# Altium project LineSensor32.PrjPcb
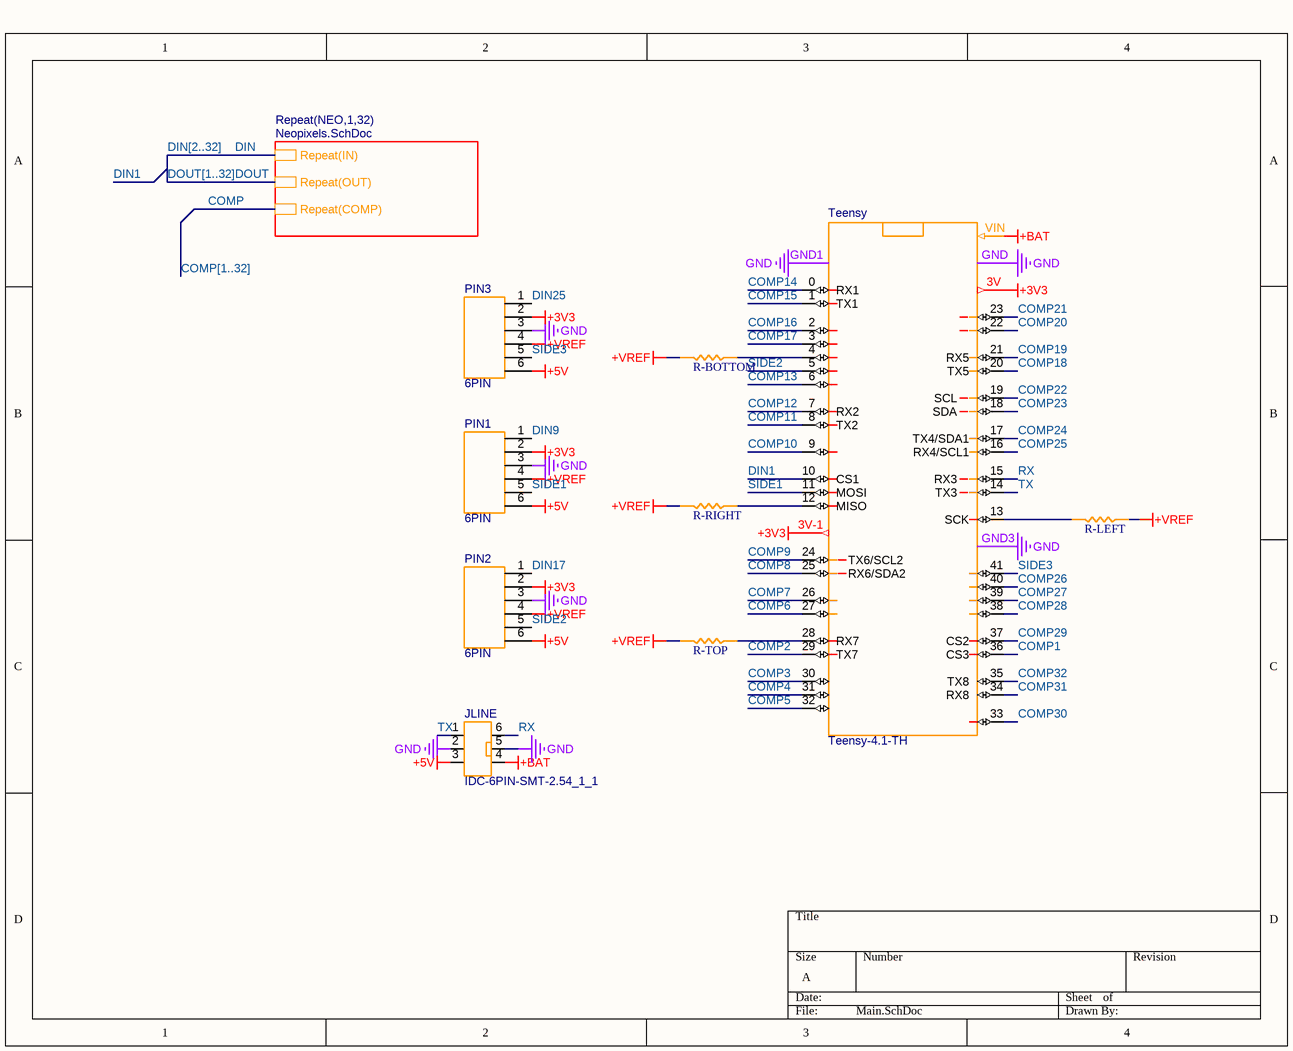
[diagram p0: Main.SchDoc]
3 sheets, 207 parts. Net scope: hierarchical (ports join the sheet entries above them; power ports are global).
Board file: LineSensor32.PcbDoc
Sheets:
  Main.SchDoc
    NEO1 = Neopixels.SchDoc
    NEO2 = Neopixels.SchDoc
    NEO3 = Neopixels.SchDoc
    NEO4 = Neopixels.SchDoc
    NEO5 = Neopixels.SchDoc
    NEO6 = Neopixels.SchDoc
    NEO7 = Neopixels.SchDoc
    NEO8 = Neopixels.SchDoc
    NEO9 = Neopixels.SchDoc
    NEO10 = Neopixels.SchDoc
    NEO11 = Neopixels.SchDoc
    NEO12 = Neopixels.SchDoc
    NEO13 = Neopixels.SchDoc
    NEO14 = Neopixels.SchDoc
    NEO15 = Neopixels.SchDoc
    NEO16 = Neopixels.SchDoc
    NEO17 = Neopixels.SchDoc
    NEO18 = Neopixels.SchDoc
    NEO19 = Neopixels.SchDoc
    NEO20 = Neopixels.SchDoc
    NEO21 = Neopixels.SchDoc
    NEO22 = Neopixels.SchDoc
    NEO23 = Neopixels.SchDoc
    NEO24 = Neopixels.SchDoc
    NEO25 = Neopixels.SchDoc
    NEO26 = Neopixels.SchDoc
    NEO27 = Neopixels.SchDoc
    NEO28 = Neopixels.SchDoc
    NEO29 = Neopixels.SchDoc
    NEO30 = Neopixels.SchDoc
    NEO31 = Neopixels.SchDoc
    NEO32 = Neopixels.SchDoc
  Comparator.SchDoc

## Sheet Main.SchDoc
size A; SheetNumber: 1; SheetTotal: 3

### Parts
JLINE  IDC-6PIN-SMT-2.54_1_1  [IDC-6PIN-SMT-2.54]
PIN1  6PIN  [6PIN]
PIN2  6PIN  [6PIN]
PIN3  6PIN  [6PIN]
R-BOTTOM  RES_0603  [RES_0603]  (value not drawn)
R-LEFT  RES_0603  [RES_0603]  (value not drawn)
R-RIGHT  RES_0603  [RES_0603]  (value not drawn)
R-TOP  RES_0603  [RES_0603]  (value not drawn)
Teensy  Teensy-4.1-TH  [Teensy-4.1-TH]

### Sub-sheets
Repeat(NEO,1,32) = Neopixels.SchDoc: Repeat(IN), Repeat(OUT), Repeat(COMP)

### Nets
+3V3: PIN1.2 PIN2.2 PIN3.2 Teensy.3V Teensy.3V-1
+5V: JLINE.3 PIN1.6 PIN2.6 PIN3.6
+BAT: JLINE.4 Teensy.VIN
+VREF: PIN1.4 PIN2.4 PIN3.4 R-BOTTOM.1 R-LEFT.2 R-RIGHT.1 R-TOP.1
GND: JLINE.2 JLINE.5 PIN1.3 PIN2.3 PIN3.3 Teensy.GND Teensy.GND1 Teensy.GND3
COMP: sheet Repeat(NEO,1,32)/Repeat(COMP)
COMP1: Teensy.36(CS3)
COMP2: Teensy.29(TX7)
COMP3: Teensy.30
COMP4: Teensy.31
COMP5: Teensy.32
COMP6: Teensy.27
COMP7: Teensy.26
COMP8: Teensy.25(RX6/SDA2)
COMP9: Teensy.24(TX6/SCL2)
COMP10: Teensy.9
COMP11: Teensy.8(TX2)
COMP12: Teensy.7(RX2)
COMP13: Teensy.6
COMP14: Teensy.0(RX1)
COMP15: Teensy.1(TX1)
COMP16: Teensy.2
COMP17: Teensy.3
COMP18: Teensy.20(TX5)
COMP19: Teensy.21(RX5)
COMP20: Teensy.22
COMP21: Teensy.23
COMP22: Teensy.19(SCL)
COMP23: Teensy.18(SDA)
COMP24: Teensy.17(TX4/SDA1)
COMP25: Teensy.16(RX4/SCL1)
COMP26: Teensy.40
COMP27: Teensy.39
COMP28: Teensy.38
COMP29: Teensy.37(CS2)
COMP30: Teensy.33
COMP31: Teensy.34(RX8)
COMP32: Teensy.35(TX8)
DIN: sheet Repeat(NEO,1,32)/Repeat(IN)
DIN1: Teensy.10(CS1)
DIN9: PIN1.1  [also labelled DOUT8]
DIN17: PIN2.1  [also labelled DOUT16]
DIN25: PIN3.1  [also labelled DOUT24]
DOUT: sheet Repeat(NEO,1,32)/Repeat(OUT)
RX: JLINE.6 Teensy.15(RX3)
SIDE1: PIN1.5 Teensy.11(MOSI)
SIDE2: PIN2.5 Teensy.5
SIDE3: PIN3.5 Teensy.41
TX: JLINE.1 Teensy.14(TX3)
NetR-BOTTOM_2: R-BOTTOM.2 Teensy.4
NetR-LEFT_1: R-LEFT.1 Teensy.13(SCK)
NetR-RIGHT_2: R-RIGHT.2 Teensy.12(MISO)
NetR-TOP_2: R-TOP.2 Teensy.28(RX7)

### Buses and harness runs
bus COMP[1..32]
bus DIN[2..32] = DOUT[1..32]

### Library data of the parts
R-BOTTOM R-LEFT R-RIGHT R-TOP = CMP-009-00178-1: Resistor SMD 0603 generic; Component Type: Standard; Pins: 2; Design Item ID: RES_0603; Source: GenericRC.SchLib

## Sheet Neopixels.SchDoc
size A; SheetNumber: 2; SheetTotal: 3
Used 32 times, as channels NEO1, NEO2, NEO3, NEO4, NEO5, NEO6, NEO7, NEO8, NEO9, NEO10, NEO11, NEO12, NEO13, NEO14, NEO15, NEO16, NEO17, NEO18, NEO19, NEO20, NEO21, NEO22, NEO23, NEO24, NEO25, NEO26, NEO27, NEO28, NEO29, NEO30, NEO31, NEO32. Parts and nets are listed once, with the designators drawn on the sheet.
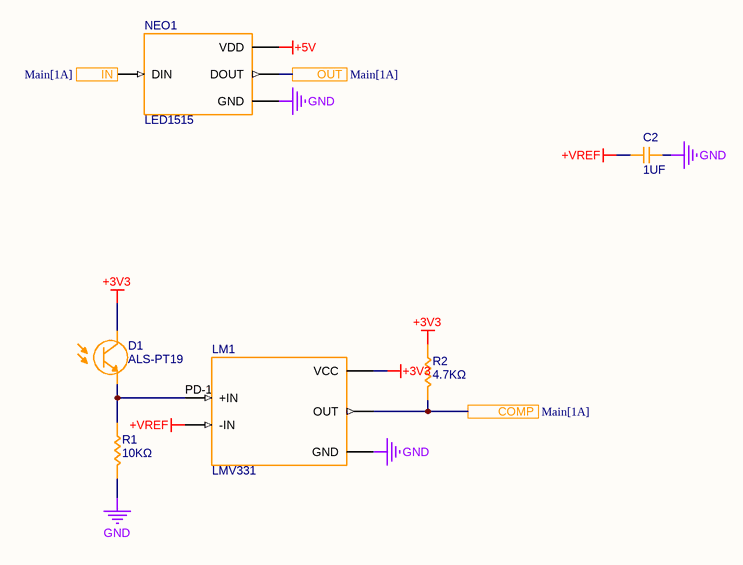
[diagram p1: Neopixels.SchDoc]

### Parts
C2  1UF  [CAP_0603]
D1  ALS-PT19  [ALS-PT19]
LM1  LMV331  [LMV331]
NEO1  LED1515  [LED1515]
R1  10KΩ  [RES_0603]
R2  4.7KΩ  [RES_0603]

### Ports
COMP (see Main[1A]), IN (see Main[1A]), OUT (see Main[1A])

### Nets
+3V3: D1.C LM1.5(VCC) R2.2
+5V: NEO1.VDD
+VREF: C2.2 LM1.3(-IN)
GND: C2.1 LM1.2(GND) NEO1.GND R1.1
COMP: LM1.4(OUT) R2.1 ; port COMP
IN: NEO1.DIN ; port IN
OUT: NEO1.DOUT ; port OUT
PD-1: D1.E LM1.1(+IN) R1.2

### Channels
NEO1: designators end in _NEO1; ports COMP=COMP1 IN=DIN1 OUT=DIN2
NEO2: designators end in _NEO2; ports COMP=COMP2 IN=DIN2 OUT=DIN3
NEO3: designators end in _NEO3; ports COMP=COMP3 IN=DIN3 OUT=DIN4
NEO4: designators end in _NEO4; ports COMP=COMP4 IN=DIN4 OUT=DIN5
NEO5: designators end in _NEO5; ports COMP=COMP5 IN=DIN5 OUT=DIN6
NEO6: designators end in _NEO6; ports COMP=COMP6 IN=DIN6 OUT=DIN7
NEO7: designators end in _NEO7; ports COMP=COMP7 IN=DIN7 OUT=DIN8
NEO8: designators end in _NEO8; ports COMP=COMP8 IN=DIN8 OUT=DIN9
NEO9: designators end in _NEO9; ports COMP=COMP9 IN=DIN9 OUT=DIN10
NEO10: designators end in _NEO10; ports COMP=COMP10 IN=DIN10 OUT=DIN11
NEO11: designators end in _NEO11; ports COMP=COMP11 IN=DIN11 OUT=DIN12
NEO12: designators end in _NEO12; ports COMP=COMP12 IN=DIN12 OUT=DIN13
NEO13: designators end in _NEO13; ports COMP=COMP13 IN=DIN13 OUT=DIN14
NEO14: designators end in _NEO14; ports COMP=COMP14 IN=DIN14 OUT=DIN15
NEO15: designators end in _NEO15; ports COMP=COMP15 IN=DIN15 OUT=DIN16
NEO16: designators end in _NEO16; ports COMP=COMP16 IN=DIN16 OUT=DIN17
NEO17: designators end in _NEO17; ports COMP=COMP17 IN=DIN17 OUT=DIN18
NEO18: designators end in _NEO18; ports COMP=COMP18 IN=DIN18 OUT=DIN19
NEO19: designators end in _NEO19; ports COMP=COMP19 IN=DIN19 OUT=DIN20
NEO20: designators end in _NEO20; ports COMP=COMP20 IN=DIN20 OUT=DIN21
NEO21: designators end in _NEO21; ports COMP=COMP21 IN=DIN21 OUT=DIN22
NEO22: designators end in _NEO22; ports COMP=COMP22 IN=DIN22 OUT=DIN23
NEO23: designators end in _NEO23; ports COMP=COMP23 IN=DIN23 OUT=DIN24
NEO24: designators end in _NEO24; ports COMP=COMP24 IN=DIN24 OUT=DIN25
NEO25: designators end in _NEO25; ports COMP=COMP25 IN=DIN25 OUT=DIN26
NEO26: designators end in _NEO26; ports COMP=COMP26 IN=DIN26 OUT=DIN27
NEO27: designators end in _NEO27; ports COMP=COMP27 IN=DIN27 OUT=DIN28
NEO28: designators end in _NEO28; ports COMP=COMP28 IN=DIN28 OUT=DIN29
NEO29: designators end in _NEO29; ports COMP=COMP29 IN=DIN29 OUT=DIN30
NEO30: designators end in _NEO30; ports COMP=COMP30 IN=DIN30 OUT=DIN31
NEO31: designators end in _NEO31; ports COMP=COMP31 IN=DIN31 OUT=DIN32
NEO32: designators end in _NEO32; ports COMP=COMP32 IN=DIN32 OUT=DOUT32

### Library data of the parts
C2 = CAP_0603: Capacitor SMD 0603 generic
R1 R2 = RES_0603: Resistor SMD 0603 generic

## Sheet Comparator.SchDoc
size A; SheetNumber: 3; SheetTotal: 3
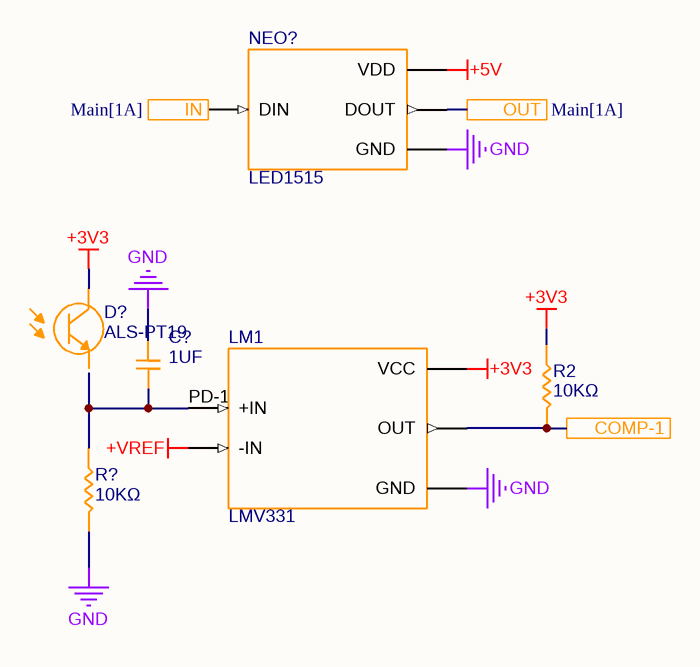
[diagram p2: Comparator.SchDoc]

### Parts
C?  1UF  [CAP_0603]
D?  ALS-PT19  [ALS-PT19]
LM1  LMV331  [LMV331]
NEO?  LED1515  [LED1515]
R2  10KΩ  [RES_0603]
R?  10KΩ  [RES_0603]

### Ports
COMP-1, IN (see Main[1A]), OUT (see Main[1A])

### Nets
+3V3: D?.C LM1.5(VCC) R2.2
+5V: NEO?.VDD
+VREF: LM1.3(-IN)
GND: C?.1 LM1.2(GND) NEO?.GND R?.1
PD-1: C?.2 LM1.1(+IN) R?.2
NetLM1_4: LM1.4(OUT) R2.1 ; port COMP-1
NetNEO?_DIN: NEO?.DIN ; port IN
NetNEO?_DOUT: NEO?.DOUT ; port OUT

Not connected (* = marked no-connect by the designer): D? E

### Library data of the parts
C? = CAP_0603: Capacitor SMD 0603 generic
R2 R? = RES_0603: Resistor SMD 0603 generic

## Nets that join several sheets
+3V3: Main (5 pins), NEO1 (D1_NEO1.C LM1_NEO1.5 R2_NEO1.2), NEO2 (D1_NEO2.C LM1_NEO2.5 R2_NEO2.2), NEO3 (D1_NEO3.C LM1_NEO3.5 R2_NEO3.2), NEO4 (D1_NEO4.C LM1_NEO4.5 R2_NEO4.2), NEO5 (D1_NEO5.C LM1_NEO5.5 R2_NEO5.2), NEO6 (D1_NEO6.C LM1_NEO6.5 R2_NEO6.2), NEO7 (D1_NEO7.C LM1_NEO7.5 R2_NEO7.2), NEO8 (D1_NEO8.C LM1_NEO8.5 R2_NEO8.2), NEO9 (D1_NEO9.C LM1_NEO9.5 R2_NEO9.2), NEO10 (D1_NEO10.C LM1_NEO10.5 R2_NEO10.2), NEO11 (D1_NEO11.C LM1_NEO11.5 R2_NEO11.2), NEO12 (D1_NEO12.C LM1_NEO12.5 R2_NEO12.2), NEO13 (D1_NEO13.C LM1_NEO13.5 R2_NEO13.2), NEO14 (D1_NEO14.C LM1_NEO14.5 R2_NEO14.2), NEO15 (D1_NEO15.C LM1_NEO15.5 R2_NEO15.2), NEO16 (D1_NEO16.C LM1_NEO16.5 R2_NEO16.2), NEO17 (D1_NEO17.C LM1_NEO17.5 R2_NEO17.2), NEO18 (D1_NEO18.C LM1_NEO18.5 R2_NEO18.2), NEO19 (D1_NEO19.C LM1_NEO19.5 R2_NEO19.2), NEO20 (D1_NEO20.C LM1_NEO20.5 R2_NEO20.2), NEO21 (D1_NEO21.C LM1_NEO21.5 R2_NEO21.2), NEO22 (D1_NEO22.C LM1_NEO22.5 R2_NEO22.2), NEO23 (D1_NEO23.C LM1_NEO23.5 R2_NEO23.2), NEO24 (D1_NEO24.C LM1_NEO24.5 R2_NEO24.2), NEO25 (D1_NEO25.C LM1_NEO25.5 R2_NEO25.2), NEO26 (D1_NEO26.C LM1_NEO26.5 R2_NEO26.2), NEO27 (D1_NEO27.C LM1_NEO27.5 R2_NEO27.2), NEO28 (D1_NEO28.C LM1_NEO28.5 R2_NEO28.2), NEO29 (D1_NEO29.C LM1_NEO29.5 R2_NEO29.2), NEO30 (D1_NEO30.C LM1_NEO30.5 R2_NEO30.2), NEO31 (D1_NEO31.C LM1_NEO31.5 R2_NEO31.2), NEO32 (D1_NEO32.C LM1_NEO32.5 R2_NEO32.2), Comparator (D?.C LM1.5 R2.2)
+5V: Main (JLINE.3 PIN1.6 PIN2.6 PIN3.6), NEO1 (NEO1_NEO1.VDD), NEO2 (NEO1_NEO2.VDD), NEO3 (NEO1_NEO3.VDD), NEO4 (NEO1_NEO4.VDD), NEO5 (NEO1_NEO5.VDD), NEO6 (NEO1_NEO6.VDD), NEO7 (NEO1_NEO7.VDD), NEO8 (NEO1_NEO8.VDD), NEO9 (NEO1_NEO9.VDD), NEO10 (NEO1_NEO10.VDD), NEO11 (NEO1_NEO11.VDD), NEO12 (NEO1_NEO12.VDD), NEO13 (NEO1_NEO13.VDD), NEO14 (NEO1_NEO14.VDD), NEO15 (NEO1_NEO15.VDD), NEO16 (NEO1_NEO16.VDD), NEO17 (NEO1_NEO17.VDD), NEO18 (NEO1_NEO18.VDD), NEO19 (NEO1_NEO19.VDD), NEO20 (NEO1_NEO20.VDD), NEO21 (NEO1_NEO21.VDD), NEO22 (NEO1_NEO22.VDD), NEO23 (NEO1_NEO23.VDD), NEO24 (NEO1_NEO24.VDD), NEO25 (NEO1_NEO25.VDD), NEO26 (NEO1_NEO26.VDD), NEO27 (NEO1_NEO27.VDD), NEO28 (NEO1_NEO28.VDD), NEO29 (NEO1_NEO29.VDD), NEO30 (NEO1_NEO30.VDD), NEO31 (NEO1_NEO31.VDD), NEO32 (NEO1_NEO32.VDD), Comparator (NEO?.VDD)
+VREF: Main (7 pins), NEO1 (C2_NEO1.2 LM1_NEO1.3), NEO2 (C2_NEO2.2 LM1_NEO2.3), NEO3 (C2_NEO3.2 LM1_NEO3.3), NEO4 (C2_NEO4.2 LM1_NEO4.3), NEO5 (C2_NEO5.2 LM1_NEO5.3), NEO6 (C2_NEO6.2 LM1_NEO6.3), NEO7 (C2_NEO7.2 LM1_NEO7.3), NEO8 (C2_NEO8.2 LM1_NEO8.3), NEO9 (C2_NEO9.2 LM1_NEO9.3), NEO10 (C2_NEO10.2 LM1_NEO10.3), NEO11 (C2_NEO11.2 LM1_NEO11.3), NEO12 (C2_NEO12.2 LM1_NEO12.3), NEO13 (C2_NEO13.2 LM1_NEO13.3), NEO14 (C2_NEO14.2 LM1_NEO14.3), NEO15 (C2_NEO15.2 LM1_NEO15.3), NEO16 (C2_NEO16.2 LM1_NEO16.3), NEO17 (C2_NEO17.2 LM1_NEO17.3), NEO18 (C2_NEO18.2 LM1_NEO18.3), NEO19 (C2_NEO19.2 LM1_NEO19.3), NEO20 (C2_NEO20.2 LM1_NEO20.3), NEO21 (C2_NEO21.2 LM1_NEO21.3), NEO22 (C2_NEO22.2 LM1_NEO22.3), NEO23 (C2_NEO23.2 LM1_NEO23.3), NEO24 (C2_NEO24.2 LM1_NEO24.3), NEO25 (C2_NEO25.2 LM1_NEO25.3), NEO26 (C2_NEO26.2 LM1_NEO26.3), NEO27 (C2_NEO27.2 LM1_NEO27.3), NEO28 (C2_NEO28.2 LM1_NEO28.3), NEO29 (C2_NEO29.2 LM1_NEO29.3), NEO30 (C2_NEO30.2 LM1_NEO30.3), NEO31 (C2_NEO31.2 LM1_NEO31.3), NEO32 (C2_NEO32.2 LM1_NEO32.3), Comparator (LM1.3)
GND: Main (8 pins), NEO1 (C2_NEO1.1 LM1_NEO1.2 NEO1_NEO1.GND R1_NEO1.1), NEO2 (C2_NEO2.1 LM1_NEO2.2 NEO1_NEO2.GND R1_NEO2.1), NEO3 (C2_NEO3.1 LM1_NEO3.2 NEO1_NEO3.GND R1_NEO3.1), NEO4 (C2_NEO4.1 LM1_NEO4.2 NEO1_NEO4.GND R1_NEO4.1), NEO5 (C2_NEO5.1 LM1_NEO5.2 NEO1_NEO5.GND R1_NEO5.1), NEO6 (C2_NEO6.1 LM1_NEO6.2 NEO1_NEO6.GND R1_NEO6.1), NEO7 (C2_NEO7.1 LM1_NEO7.2 NEO1_NEO7.GND R1_NEO7.1), NEO8 (C2_NEO8.1 LM1_NEO8.2 NEO1_NEO8.GND R1_NEO8.1), NEO9 (C2_NEO9.1 LM1_NEO9.2 NEO1_NEO9.GND R1_NEO9.1), NEO10 (C2_NEO10.1 LM1_NEO10.2 NEO1_NEO10.GND R1_NEO10.1), NEO11 (C2_NEO11.1 LM1_NEO11.2 NEO1_NEO11.GND R1_NEO11.1), NEO12 (C2_NEO12.1 LM1_NEO12.2 NEO1_NEO12.GND R1_NEO12.1), NEO13 (C2_NEO13.1 LM1_NEO13.2 NEO1_NEO13.GND R1_NEO13.1), NEO14 (C2_NEO14.1 LM1_NEO14.2 NEO1_NEO14.GND R1_NEO14.1), NEO15 (C2_NEO15.1 LM1_NEO15.2 NEO1_NEO15.GND R1_NEO15.1), NEO16 (C2_NEO16.1 LM1_NEO16.2 NEO1_NEO16.GND R1_NEO16.1), NEO17 (C2_NEO17.1 LM1_NEO17.2 NEO1_NEO17.GND R1_NEO17.1), NEO18 (C2_NEO18.1 LM1_NEO18.2 NEO1_NEO18.GND R1_NEO18.1), NEO19 (C2_NEO19.1 LM1_NEO19.2 NEO1_NEO19.GND R1_NEO19.1), NEO20 (C2_NEO20.1 LM1_NEO20.2 NEO1_NEO20.GND R1_NEO20.1), NEO21 (C2_NEO21.1 LM1_NEO21.2 NEO1_NEO21.GND R1_NEO21.1), NEO22 (C2_NEO22.1 LM1_NEO22.2 NEO1_NEO22.GND R1_NEO22.1), NEO23 (C2_NEO23.1 LM1_NEO23.2 NEO1_NEO23.GND R1_NEO23.1), NEO24 (C2_NEO24.1 LM1_NEO24.2 NEO1_NEO24.GND R1_NEO24.1), NEO25 (C2_NEO25.1 LM1_NEO25.2 NEO1_NEO25.GND R1_NEO25.1), NEO26 (C2_NEO26.1 LM1_NEO26.2 NEO1_NEO26.GND R1_NEO26.1), NEO27 (C2_NEO27.1 LM1_NEO27.2 NEO1_NEO27.GND R1_NEO27.1), NEO28 (C2_NEO28.1 LM1_NEO28.2 NEO1_NEO28.GND R1_NEO28.1), NEO29 (C2_NEO29.1 LM1_NEO29.2 NEO1_NEO29.GND R1_NEO29.1), NEO30 (C2_NEO30.1 LM1_NEO30.2 NEO1_NEO30.GND R1_NEO30.1), NEO31 (C2_NEO31.1 LM1_NEO31.2 NEO1_NEO31.GND R1_NEO31.1), NEO32 (C2_NEO32.1 LM1_NEO32.2 NEO1_NEO32.GND R1_NEO32.1), Comparator (C?.1 LM1.2 NEO?.GND R?.1)
COMP1: Main (Teensy.36), NEO1 (LM1_NEO1.4 R2_NEO1.1)
COMP2: Main (Teensy.29), NEO2 (LM1_NEO2.4 R2_NEO2.1)
COMP3: Main (Teensy.30), NEO3 (LM1_NEO3.4 R2_NEO3.1)
COMP4: Main (Teensy.31), NEO4 (LM1_NEO4.4 R2_NEO4.1)
COMP5: Main (Teensy.32), NEO5 (LM1_NEO5.4 R2_NEO5.1)
COMP6: Main (Teensy.27), NEO6 (LM1_NEO6.4 R2_NEO6.1)
COMP7: Main (Teensy.26), NEO7 (LM1_NEO7.4 R2_NEO7.1)
COMP8: Main (Teensy.25), NEO8 (LM1_NEO8.4 R2_NEO8.1)
COMP9: Main (Teensy.24), NEO9 (LM1_NEO9.4 R2_NEO9.1)
COMP10: Main (Teensy.9), NEO10 (LM1_NEO10.4 R2_NEO10.1)
COMP11: Main (Teensy.8), NEO11 (LM1_NEO11.4 R2_NEO11.1)
COMP12: Main (Teensy.7), NEO12 (LM1_NEO12.4 R2_NEO12.1)
COMP13: Main (Teensy.6), NEO13 (LM1_NEO13.4 R2_NEO13.1)
COMP14: Main (Teensy.0), NEO14 (LM1_NEO14.4 R2_NEO14.1)
COMP15: Main (Teensy.1), NEO15 (LM1_NEO15.4 R2_NEO15.1)
COMP16: Main (Teensy.2), NEO16 (LM1_NEO16.4 R2_NEO16.1)
COMP17: Main (Teensy.3), NEO17 (LM1_NEO17.4 R2_NEO17.1)
COMP18: Main (Teensy.20), NEO18 (LM1_NEO18.4 R2_NEO18.1)
COMP19: Main (Teensy.21), NEO19 (LM1_NEO19.4 R2_NEO19.1)
COMP20: Main (Teensy.22), NEO20 (LM1_NEO20.4 R2_NEO20.1)
COMP21: Main (Teensy.23), NEO21 (LM1_NEO21.4 R2_NEO21.1)
COMP22: Main (Teensy.19), NEO22 (LM1_NEO22.4 R2_NEO22.1)
COMP23: Main (Teensy.18), NEO23 (LM1_NEO23.4 R2_NEO23.1)
COMP24: Main (Teensy.17), NEO24 (LM1_NEO24.4 R2_NEO24.1)
COMP25: Main (Teensy.16), NEO25 (LM1_NEO25.4 R2_NEO25.1)
COMP26: Main (Teensy.40), NEO26 (LM1_NEO26.4 R2_NEO26.1)
COMP27: Main (Teensy.39), NEO27 (LM1_NEO27.4 R2_NEO27.1)
COMP28: Main (Teensy.38), NEO28 (LM1_NEO28.4 R2_NEO28.1)
COMP29: Main (Teensy.37), NEO29 (LM1_NEO29.4 R2_NEO29.1)
COMP30: Main (Teensy.33), NEO30 (LM1_NEO30.4 R2_NEO30.1)
COMP31: Main (Teensy.34), NEO31 (LM1_NEO31.4 R2_NEO31.1)
COMP32: Main (Teensy.35), NEO32 (LM1_NEO32.4 R2_NEO32.1)
DIN1: Main (Teensy.10), NEO1 (NEO1_NEO1.DIN)
DIN2: NEO1 (NEO1_NEO1.DOUT), NEO2 (NEO1_NEO2.DIN)
DIN3: NEO2 (NEO1_NEO2.DOUT), NEO3 (NEO1_NEO3.DIN)
DIN4: NEO3 (NEO1_NEO3.DOUT), NEO4 (NEO1_NEO4.DIN)
DIN5: NEO4 (NEO1_NEO4.DOUT), NEO5 (NEO1_NEO5.DIN)
DIN6: NEO5 (NEO1_NEO5.DOUT), NEO6 (NEO1_NEO6.DIN)
DIN7: NEO6 (NEO1_NEO6.DOUT), NEO7 (NEO1_NEO7.DIN)
DIN8: NEO7 (NEO1_NEO7.DOUT), NEO8 (NEO1_NEO8.DIN)
DIN9: Main (PIN1.1), NEO8 (NEO1_NEO8.DOUT), NEO9 (NEO1_NEO9.DIN)
DIN10: NEO9 (NEO1_NEO9.DOUT), NEO10 (NEO1_NEO10.DIN)
DIN11: NEO10 (NEO1_NEO10.DOUT), NEO11 (NEO1_NEO11.DIN)
DIN12: NEO11 (NEO1_NEO11.DOUT), NEO12 (NEO1_NEO12.DIN)
DIN13: NEO12 (NEO1_NEO12.DOUT), NEO13 (NEO1_NEO13.DIN)
DIN14: NEO13 (NEO1_NEO13.DOUT), NEO14 (NEO1_NEO14.DIN)
DIN15: NEO14 (NEO1_NEO14.DOUT), NEO15 (NEO1_NEO15.DIN)
DIN16: NEO15 (NEO1_NEO15.DOUT), NEO16 (NEO1_NEO16.DIN)
DIN17: Main (PIN2.1), NEO16 (NEO1_NEO16.DOUT), NEO17 (NEO1_NEO17.DIN)
DIN18: NEO17 (NEO1_NEO17.DOUT), NEO18 (NEO1_NEO18.DIN)
DIN19: NEO18 (NEO1_NEO18.DOUT), NEO19 (NEO1_NEO19.DIN)
DIN20: NEO19 (NEO1_NEO19.DOUT), NEO20 (NEO1_NEO20.DIN)
DIN21: NEO20 (NEO1_NEO20.DOUT), NEO21 (NEO1_NEO21.DIN)
DIN22: NEO21 (NEO1_NEO21.DOUT), NEO22 (NEO1_NEO22.DIN)
DIN23: NEO22 (NEO1_NEO22.DOUT), NEO23 (NEO1_NEO23.DIN)
DIN24: NEO23 (NEO1_NEO23.DOUT), NEO24 (NEO1_NEO24.DIN)
DIN25: Main (PIN3.1), NEO24 (NEO1_NEO24.DOUT), NEO25 (NEO1_NEO25.DIN)
DIN26: NEO25 (NEO1_NEO25.DOUT), NEO26 (NEO1_NEO26.DIN)
DIN27: NEO26 (NEO1_NEO26.DOUT), NEO27 (NEO1_NEO27.DIN)
DIN28: NEO27 (NEO1_NEO27.DOUT), NEO28 (NEO1_NEO28.DIN)
DIN29: NEO28 (NEO1_NEO28.DOUT), NEO29 (NEO1_NEO29.DIN)
DIN30: NEO29 (NEO1_NEO29.DOUT), NEO30 (NEO1_NEO30.DIN)
DIN31: NEO30 (NEO1_NEO30.DOUT), NEO31 (NEO1_NEO31.DIN)
DIN32: NEO31 (NEO1_NEO31.DOUT), NEO32 (NEO1_NEO32.DIN)